# Altium schematic sheet LDO.SchDoc
size 420 x 297 mm; SheetNumber: 3; SheetTotal: 5
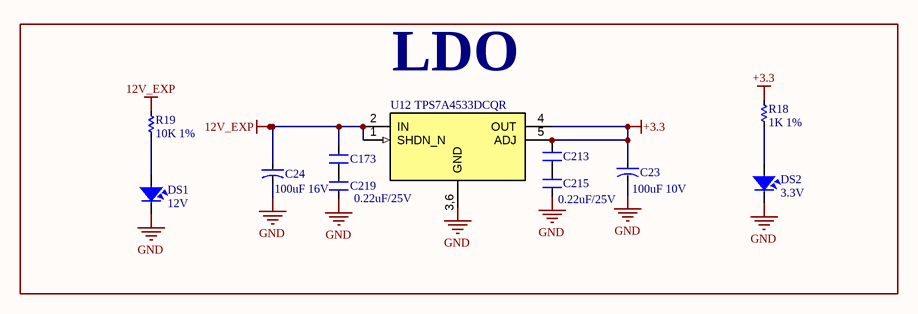
[diagram p0: LDO.SchDoc]

## Parts
C23  100uF 10V  [CAP_TANT_1206]
C24  100uF 16V  [CAP_TANT_1206]
C173  0.22uF/25V  [SM-0603]
C213  0.22uF/25V  [SM-0603]  (value not drawn)
C215  0.22uF/25V  [SM-0603]
C219  0.22uF/25V  [SM-0603]  (value not drawn)
DS1  12V  [GREENLED_0603]
DS2  3.3V  [GREENLED_0603]
R18  1K 1%  [RES-SMD-0603]
R19  10K 1%  [RES-SMD-0603]
U12  TPS7A4533DCQR  [SOT223-6]

## Blocks framed on the sheet
LDO: C23 C24 C173 C213 C215 C219 DS1 DS2 R18 R19 U12

## Nets
12V_EXP: C24.1 C173.2 R19.2 U12.1(SHDN_N) U12.2(IN)
+3.3: C23.1 C213.2 R18.2 U12.4(OUT) U12.5(ADJ)
GND: C23.2 C24.2 C215.1 C219.1 DS1.2 DS2.2 U12.3,6(GND)
NetC173_1: C173.1 C219.2
NetC213_1: C213.1 C215.2
NetDS1_1: DS1.1 R19.1
NetDS2_1: DS2.1 R18.1

## Notes on the sheet
- Project:
- BEE-PC1
- Sub-system:
- Design by:
- Hung Nguyen D.
- Bao Bui Q.
- Sheet title:
- Sheet
- A3
- of
- Checked by:
- Approved by:
- Vu Pham
- Revision:
- Document No:
- V1.2.0
- Size:
- Date:

## Library data of the parts
C23 C24 = CN-ALU-SMD: Polarized Capacitor (Axial); Published: 8-Jun-2000; LatestRevisionDate: 17-Jul-2002; LatestRevisionNote: Re-released for DXP Platform.; PackageReference: POLAR0.8; Publisher: Altium Limited
C173 C213 C215 C219 = CM: 0603; Value: 103
DS1 DS2 = LED SMD: Value: LED 3 - 5 ly 2 Colour
R18 R19 = Res-SMD: 0603; Manufacturer: Generic Components; Class: Passive; Published: 08/06/2000; Publisher: Altium Hobart Technology Centre
U12 = TPS7A4533DCQR: IC REG LINEAR 3.3V 1.5A SOT223-6